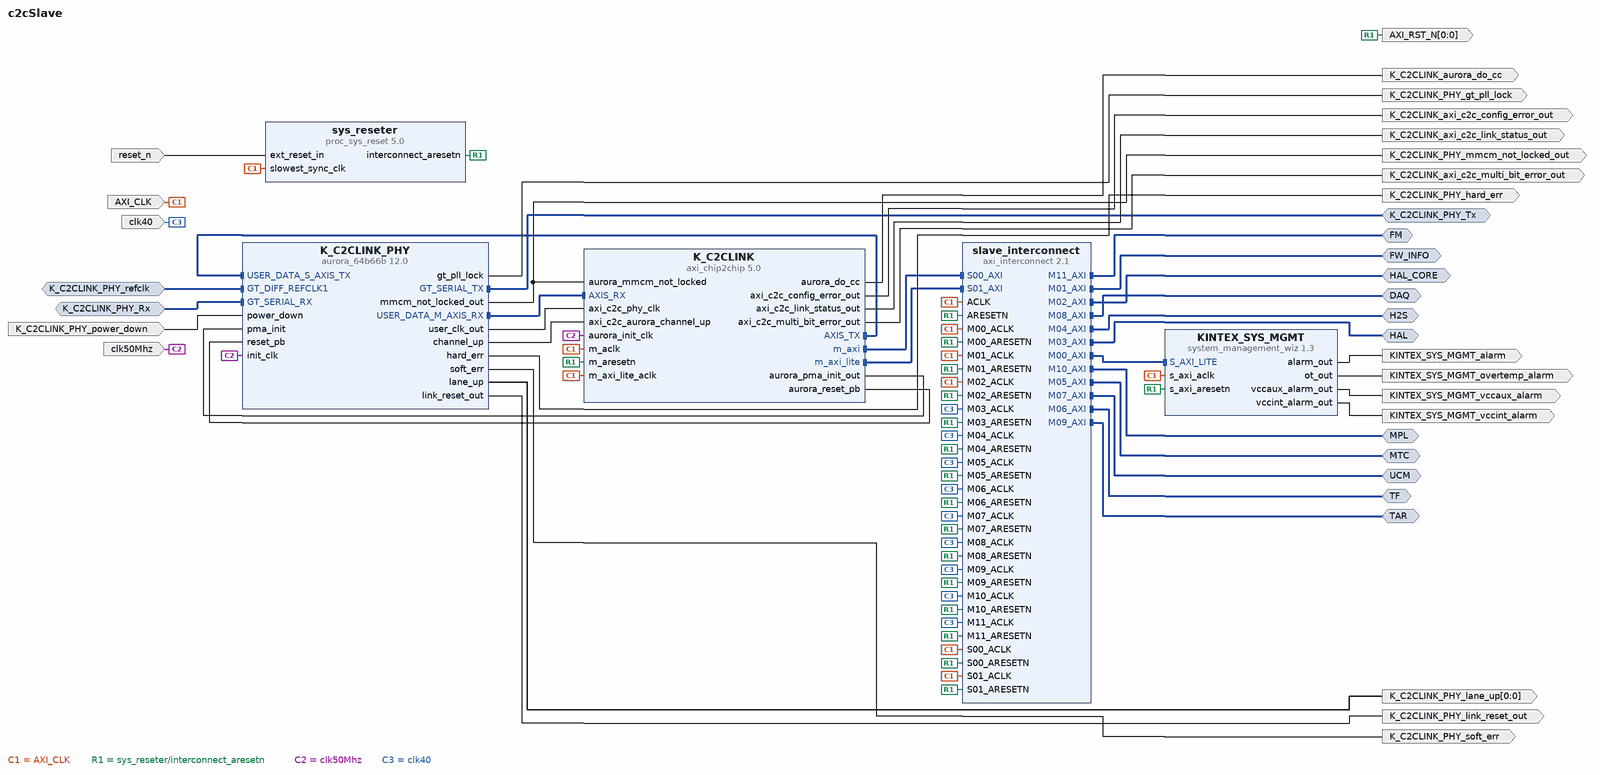
[diagram p0: block diagram of the top level]
# Vivado block design c2cSlave, xcku15p-ffva1760-2-e, Vivado 2020.2
create_bd_design c2cSlave

create_bd_intf_port -mode Slave -vlnv xilinx.com:interface:diff_clock_rtl:1.0 K_C2CLINK_PHY_refclk
set_property -dict {CONFIG.FREQ_HZ 200000000} [get_bd_intf_ports K_C2CLINK_PHY_refclk]
create_bd_intf_port -mode Slave -vlnv xilinx.com:display_aurora:GT_Serial_Transceiver_Pins_RX_rtl:1.0 K_C2CLINK_PHY_Rx
create_bd_intf_port -mode Master -vlnv xilinx.com:display_aurora:GT_Serial_Transceiver_Pins_TX_rtl:1.0 K_C2CLINK_PHY_Tx
create_bd_intf_port -mode Master -vlnv xilinx.com:interface:aximm_rtl:1.0 FW_INFO
set_property -dict [list \
  CONFIG.ADDR_WIDTH 32 \
  CONFIG.DATA_WIDTH 32 \
  CONFIG.FREQ_HZ 50000000 \
  CONFIG.HAS_BURST 0 \
  CONFIG.HAS_CACHE 0 \
  CONFIG.HAS_LOCK 0 \
  CONFIG.HAS_QOS 0 \
  CONFIG.HAS_REGION 0 \
  CONFIG.PROTOCOL AXI4LITE \
] [get_bd_intf_ports FW_INFO]
create_bd_intf_port -mode Master -vlnv xilinx.com:interface:aximm_rtl:1.0 HAL_CORE
set_property -dict [list \
  CONFIG.ADDR_WIDTH 32 \
  CONFIG.DATA_WIDTH 32 \
  CONFIG.FREQ_HZ 50000000 \
  CONFIG.HAS_BURST 0 \
  CONFIG.HAS_CACHE 0 \
  CONFIG.HAS_LOCK 0 \
  CONFIG.HAS_QOS 0 \
  CONFIG.HAS_REGION 0 \
  CONFIG.PROTOCOL AXI4LITE \
] [get_bd_intf_ports HAL_CORE]
create_bd_intf_port -mode Master -vlnv xilinx.com:interface:aximm_rtl:1.0 HAL
set_property -dict [list \
  CONFIG.ADDR_WIDTH 32 \
  CONFIG.DATA_WIDTH 32 \
  CONFIG.HAS_BURST 0 \
  CONFIG.HAS_CACHE 0 \
  CONFIG.HAS_LOCK 0 \
  CONFIG.HAS_QOS 0 \
  CONFIG.HAS_REGION 0 \
  CONFIG.PROTOCOL AXI4LITE \
] [get_bd_intf_ports HAL]
create_bd_intf_port -mode Master -vlnv xilinx.com:interface:aximm_rtl:1.0 H2S
set_property -dict [list \
  CONFIG.ADDR_WIDTH 32 \
  CONFIG.DATA_WIDTH 32 \
  CONFIG.HAS_BURST 0 \
  CONFIG.HAS_CACHE 0 \
  CONFIG.HAS_LOCK 0 \
  CONFIG.HAS_QOS 0 \
  CONFIG.HAS_REGION 0 \
  CONFIG.PROTOCOL AXI4LITE \
] [get_bd_intf_ports H2S]
create_bd_intf_port -mode Master -vlnv xilinx.com:interface:aximm_rtl:1.0 MTC
set_property -dict [list \
  CONFIG.ADDR_WIDTH 32 \
  CONFIG.DATA_WIDTH 32 \
  CONFIG.HAS_BURST 0 \
  CONFIG.HAS_CACHE 0 \
  CONFIG.HAS_LOCK 0 \
  CONFIG.HAS_QOS 0 \
  CONFIG.HAS_REGION 0 \
  CONFIG.PROTOCOL AXI4LITE \
] [get_bd_intf_ports MTC]
create_bd_intf_port -mode Master -vlnv xilinx.com:interface:aximm_rtl:1.0 TF
set_property -dict [list \
  CONFIG.ADDR_WIDTH 32 \
  CONFIG.DATA_WIDTH 32 \
  CONFIG.HAS_BURST 0 \
  CONFIG.HAS_CACHE 0 \
  CONFIG.HAS_LOCK 0 \
  CONFIG.HAS_QOS 0 \
  CONFIG.HAS_REGION 0 \
  CONFIG.PROTOCOL AXI4LITE \
] [get_bd_intf_ports TF]
create_bd_intf_port -mode Master -vlnv xilinx.com:interface:aximm_rtl:1.0 UCM
set_property -dict [list \
  CONFIG.ADDR_WIDTH 32 \
  CONFIG.DATA_WIDTH 32 \
  CONFIG.HAS_BURST 0 \
  CONFIG.HAS_CACHE 0 \
  CONFIG.HAS_LOCK 0 \
  CONFIG.HAS_QOS 0 \
  CONFIG.HAS_REGION 0 \
  CONFIG.PROTOCOL AXI4LITE \
] [get_bd_intf_ports UCM]
create_bd_intf_port -mode Master -vlnv xilinx.com:interface:aximm_rtl:1.0 DAQ
set_property -dict [list \
  CONFIG.ADDR_WIDTH 32 \
  CONFIG.DATA_WIDTH 32 \
  CONFIG.HAS_BURST 0 \
  CONFIG.HAS_CACHE 0 \
  CONFIG.HAS_LOCK 0 \
  CONFIG.HAS_QOS 0 \
  CONFIG.HAS_REGION 0 \
  CONFIG.PROTOCOL AXI4LITE \
] [get_bd_intf_ports DAQ]
create_bd_intf_port -mode Master -vlnv xilinx.com:interface:aximm_rtl:1.0 TAR
set_property -dict [list \
  CONFIG.ADDR_WIDTH 32 \
  CONFIG.DATA_WIDTH 32 \
  CONFIG.HAS_BURST 0 \
  CONFIG.HAS_CACHE 0 \
  CONFIG.HAS_LOCK 0 \
  CONFIG.HAS_QOS 0 \
  CONFIG.HAS_REGION 0 \
  CONFIG.PROTOCOL AXI4LITE \
] [get_bd_intf_ports TAR]
create_bd_intf_port -mode Master -vlnv xilinx.com:interface:aximm_rtl:1.0 MPL
set_property -dict [list \
  CONFIG.ADDR_WIDTH 32 \
  CONFIG.DATA_WIDTH 32 \
  CONFIG.HAS_BURST 0 \
  CONFIG.HAS_CACHE 0 \
  CONFIG.HAS_LOCK 0 \
  CONFIG.HAS_QOS 0 \
  CONFIG.HAS_REGION 0 \
  CONFIG.PROTOCOL AXI4LITE \
] [get_bd_intf_ports MPL]
create_bd_intf_port -mode Master -vlnv xilinx.com:interface:aximm_rtl:1.0 FM
set_property -dict [list \
  CONFIG.ADDR_WIDTH 32 \
  CONFIG.DATA_WIDTH 32 \
  CONFIG.HAS_BURST 0 \
  CONFIG.HAS_CACHE 0 \
  CONFIG.HAS_LOCK 0 \
  CONFIG.HAS_QOS 0 \
  CONFIG.HAS_REGION 0 \
  CONFIG.PROTOCOL AXI4LITE \
] [get_bd_intf_ports FM]
create_bd_port -dir I -type clk clk50Mhz
set_property -dict {CONFIG.FREQ_HZ 50000000} [get_bd_ports clk50Mhz]
create_bd_port -dir I -type rst reset_n
create_bd_port -dir I -type clk AXI_CLK
set_property -dict {CONFIG.ASSOCIATED_BUSIF HAL_CORE:FW_INFO CONFIG.FREQ_HZ 50000000} [get_bd_ports AXI_CLK]
create_bd_port -dir O -from 0 -to 0 -type rst AXI_RST_N
create_bd_port -dir O K_C2CLINK_aurora_do_cc
create_bd_port -dir O K_C2CLINK_axi_c2c_config_error_out
create_bd_port -dir O K_C2CLINK_axi_c2c_link_status_out
create_bd_port -dir O K_C2CLINK_axi_c2c_multi_bit_error_out
create_bd_port -dir I -type rst K_C2CLINK_PHY_power_down
create_bd_port -dir O K_C2CLINK_PHY_gt_pll_lock
create_bd_port -dir O K_C2CLINK_PHY_hard_err
create_bd_port -dir O K_C2CLINK_PHY_soft_err
create_bd_port -dir O -from 0 -to 0 K_C2CLINK_PHY_lane_up
create_bd_port -dir O K_C2CLINK_PHY_mmcm_not_locked_out
create_bd_port -dir O -type rst K_C2CLINK_PHY_link_reset_out
create_bd_port -dir O KINTEX_SYS_MGMT_alarm
create_bd_port -dir O KINTEX_SYS_MGMT_vccint_alarm
create_bd_port -dir O KINTEX_SYS_MGMT_vccaux_alarm
create_bd_port -dir O KINTEX_SYS_MGMT_overtemp_alarm
create_bd_port -dir I -type clk clk40
set_property -dict {CONFIG.ASSOCIATED_BUSIF FM:HAL:H2S:MTC:TF:UCM:DAQ:TAR:MPL} [get_bd_ports clk40]

create_bd_cell -type ip -vlnv xilinx.com:ip:proc_sys_reset:5.0 sys_reseter
create_bd_cell -type ip -vlnv xilinx.com:ip:axi_chip2chip:5.0 K_C2CLINK
set_property -dict [list \
  CONFIG.C_AXI_DATA_WIDTH 32 \
  CONFIG.C_AXI_STB_WIDTH 4 \
  CONFIG.C_EN_AXI_LINK_HNDLR false \
  CONFIG.C_INCLUDE_AXILITE 2 \
  CONFIG.C_INTERFACE_MODE 0 \
  CONFIG.C_INTERFACE_TYPE 2 \
  CONFIG.C_MASTER_FPGA 0 \
  CONFIG.C_M_AXI_ID_WIDTH 0 \
  CONFIG.C_M_AXI_WUSER_WIDTH 0 \
] [get_bd_cells K_C2CLINK]
create_bd_cell -type ip -vlnv xilinx.com:ip:aurora_64b66b:12.0 K_C2CLINK_PHY
set_property -dict [list \
  CONFIG.CHANNEL_ENABLE X0Y0 \
  CONFIG.C_AURORA_LANES 1 \
  CONFIG.C_LINE_RATE 5 \
  CONFIG.C_REFCLK_FREQUENCY 200 \
  CONFIG.C_USE_CHIPSCOPE true \
  CONFIG.SupportLevel 1 \
  CONFIG.drp_mode AXI4_LITE \
  CONFIG.interface_mode Streaming \
] [get_bd_cells K_C2CLINK_PHY]
create_bd_cell -type ip -vlnv xilinx.com:ip:axi_interconnect:2.1 slave_interconnect
set_property -dict {CONFIG.NUM_MI 12 CONFIG.NUM_SI 2} [get_bd_cells slave_interconnect]
create_bd_cell -type ip -vlnv xilinx.com:ip:system_management_wiz:1.3 KINTEX_SYS_MGMT
set_property -dict {CONFIG.USER_TEMP_ALARM false} [get_bd_cells KINTEX_SYS_MGMT]

# ---- connections ----

connect_bd_intf_net [get_bd_intf_ports HAL_CORE] [get_bd_intf_pins slave_interconnect/M02_AXI]
connect_bd_intf_net [get_bd_intf_pins KINTEX_SYS_MGMT/S_AXI_LITE] [get_bd_intf_pins slave_interconnect/M00_AXI]
connect_bd_intf_net [get_bd_intf_ports FW_INFO] [get_bd_intf_pins slave_interconnect/M01_AXI]
connect_bd_intf_net [get_bd_intf_pins K_C2CLINK/m_axi] [get_bd_intf_pins slave_interconnect/S00_AXI]
connect_bd_intf_net [get_bd_intf_pins K_C2CLINK/m_axi_lite] [get_bd_intf_pins slave_interconnect/S01_AXI]
connect_bd_intf_net [get_bd_intf_ports FM] [get_bd_intf_pins slave_interconnect/M11_AXI]
connect_bd_intf_net [get_bd_intf_ports H2S] [get_bd_intf_pins slave_interconnect/M04_AXI]
connect_bd_intf_net [get_bd_intf_ports HAL] [get_bd_intf_pins slave_interconnect/M03_AXI]
connect_bd_intf_net [get_bd_intf_ports MPL] [get_bd_intf_pins slave_interconnect/M10_AXI]
connect_bd_intf_net [get_bd_intf_ports UCM] [get_bd_intf_pins slave_interconnect/M07_AXI]
connect_bd_intf_net [get_bd_intf_ports DAQ] [get_bd_intf_pins slave_interconnect/M08_AXI]
connect_bd_intf_net [get_bd_intf_ports TF] [get_bd_intf_pins slave_interconnect/M06_AXI]
connect_bd_intf_net [get_bd_intf_ports K_C2CLINK_PHY_refclk] [get_bd_intf_pins K_C2CLINK_PHY/GT_DIFF_REFCLK1]
connect_bd_intf_net [get_bd_intf_ports MTC] [get_bd_intf_pins slave_interconnect/M05_AXI]
connect_bd_intf_net [get_bd_intf_ports K_C2CLINK_PHY_Tx] [get_bd_intf_pins K_C2CLINK_PHY/GT_SERIAL_TX]
connect_bd_intf_net [get_bd_intf_ports K_C2CLINK_PHY_Rx] [get_bd_intf_pins K_C2CLINK_PHY/GT_SERIAL_RX]
connect_bd_intf_net [get_bd_intf_ports TAR] [get_bd_intf_pins slave_interconnect/M09_AXI]
connect_bd_intf_net [get_bd_intf_pins K_C2CLINK/AXIS_TX] [get_bd_intf_pins K_C2CLINK_PHY/USER_DATA_S_AXIS_TX]
connect_bd_intf_net [get_bd_intf_pins K_C2CLINK_PHY/USER_DATA_M_AXIS_RX] [get_bd_intf_pins K_C2CLINK/AXIS_RX]
connect_bd_net [get_bd_ports reset_n] [get_bd_pins sys_reseter/ext_reset_in]
connect_bd_net [get_bd_ports AXI_CLK] \
  [get_bd_pins sys_reseter/slowest_sync_clk] [get_bd_pins K_C2CLINK/m_aclk] [get_bd_pins K_C2CLINK/m_axi_lite_aclk] \
  [get_bd_pins slave_interconnect/ACLK] [get_bd_pins slave_interconnect/S00_ACLK] [get_bd_pins slave_interconnect/S01_ACLK] \
  [get_bd_pins slave_interconnect/M00_ACLK] [get_bd_pins KINTEX_SYS_MGMT/s_axi_aclk] \
  [get_bd_pins slave_interconnect/M01_ACLK] [get_bd_pins slave_interconnect/M02_ACLK]
connect_bd_net [get_bd_pins sys_reseter/interconnect_aresetn] \
  [get_bd_ports AXI_RST_N] [get_bd_pins K_C2CLINK/m_aresetn] [get_bd_pins slave_interconnect/ARESETN] \
  [get_bd_pins slave_interconnect/S00_ARESETN] [get_bd_pins slave_interconnect/S01_ARESETN] \
  [get_bd_pins slave_interconnect/M00_ARESETN] [get_bd_pins KINTEX_SYS_MGMT/s_axi_aresetn] \
  [get_bd_pins slave_interconnect/M01_ARESETN] [get_bd_pins slave_interconnect/M02_ARESETN] \
  [get_bd_pins slave_interconnect/M03_ARESETN] [get_bd_pins slave_interconnect/M04_ARESETN] \
  [get_bd_pins slave_interconnect/M05_ARESETN] [get_bd_pins slave_interconnect/M06_ARESETN] \
  [get_bd_pins slave_interconnect/M07_ARESETN] [get_bd_pins slave_interconnect/M08_ARESETN] \
  [get_bd_pins slave_interconnect/M09_ARESETN] [get_bd_pins slave_interconnect/M10_ARESETN] \
  [get_bd_pins slave_interconnect/M11_ARESETN]
connect_bd_net [get_bd_pins K_C2CLINK/aurora_do_cc] [get_bd_ports K_C2CLINK_aurora_do_cc]
connect_bd_net [get_bd_pins K_C2CLINK/axi_c2c_config_error_out] [get_bd_ports K_C2CLINK_axi_c2c_config_error_out]
connect_bd_net [get_bd_pins K_C2CLINK/axi_c2c_link_status_out] [get_bd_ports K_C2CLINK_axi_c2c_link_status_out]
connect_bd_net [get_bd_pins K_C2CLINK/axi_c2c_multi_bit_error_out] [get_bd_ports K_C2CLINK_axi_c2c_multi_bit_error_out]
connect_bd_net [get_bd_ports K_C2CLINK_PHY_power_down] [get_bd_pins K_C2CLINK_PHY/power_down]
connect_bd_net [get_bd_pins K_C2CLINK_PHY/gt_pll_lock] [get_bd_ports K_C2CLINK_PHY_gt_pll_lock]
connect_bd_net [get_bd_pins K_C2CLINK_PHY/hard_err] [get_bd_ports K_C2CLINK_PHY_hard_err]
connect_bd_net [get_bd_pins K_C2CLINK_PHY/soft_err] [get_bd_ports K_C2CLINK_PHY_soft_err]
connect_bd_net [get_bd_pins K_C2CLINK_PHY/lane_up] [get_bd_ports K_C2CLINK_PHY_lane_up]
connect_bd_net [get_bd_pins K_C2CLINK_PHY/mmcm_not_locked_out] \
  [get_bd_ports K_C2CLINK_PHY_mmcm_not_locked_out] [get_bd_pins K_C2CLINK/aurora_mmcm_not_locked]
connect_bd_net [get_bd_pins K_C2CLINK_PHY/link_reset_out] [get_bd_ports K_C2CLINK_PHY_link_reset_out]
connect_bd_net [get_bd_pins K_C2CLINK_PHY/user_clk_out] [get_bd_pins K_C2CLINK/axi_c2c_phy_clk]
connect_bd_net [get_bd_pins K_C2CLINK_PHY/channel_up] [get_bd_pins K_C2CLINK/axi_c2c_aurora_channel_up]
connect_bd_net [get_bd_pins K_C2CLINK/aurora_pma_init_out] [get_bd_pins K_C2CLINK_PHY/pma_init]
connect_bd_net [get_bd_pins K_C2CLINK/aurora_reset_pb] [get_bd_pins K_C2CLINK_PHY/reset_pb]
connect_bd_net [get_bd_ports clk50Mhz] [get_bd_pins K_C2CLINK_PHY/init_clk] [get_bd_pins K_C2CLINK/aurora_init_clk]
connect_bd_net [get_bd_pins KINTEX_SYS_MGMT/alarm_out] [get_bd_ports KINTEX_SYS_MGMT_alarm]
connect_bd_net [get_bd_pins KINTEX_SYS_MGMT/vccint_alarm_out] [get_bd_ports KINTEX_SYS_MGMT_vccint_alarm]
connect_bd_net [get_bd_pins KINTEX_SYS_MGMT/vccaux_alarm_out] [get_bd_ports KINTEX_SYS_MGMT_vccaux_alarm]
connect_bd_net [get_bd_pins KINTEX_SYS_MGMT/ot_out] [get_bd_ports KINTEX_SYS_MGMT_overtemp_alarm]
connect_bd_net -net clk40_1 [get_bd_ports clk40] \
  [get_bd_pins slave_interconnect/M03_ACLK] [get_bd_pins slave_interconnect/M04_ACLK] \
  [get_bd_pins slave_interconnect/M05_ACLK] [get_bd_pins slave_interconnect/M06_ACLK] \
  [get_bd_pins slave_interconnect/M07_ACLK] [get_bd_pins slave_interconnect/M08_ACLK] \
  [get_bd_pins slave_interconnect/M09_ACLK] [get_bd_pins slave_interconnect/M10_ACLK] \
  [get_bd_pins slave_interconnect/M11_ACLK]

# ---- address map ----
assign_bd_address -offset 0x83C45000 -range 4K -target_address_space [get_bd_addr_spaces K_C2CLINK/MAXI] [get_bd_addr_segs KINTEX_SYS_MGMT/S_AXI_LITE/Reg]
assign_bd_address -offset 0x83C46000 -range 4K -target_address_space [get_bd_addr_spaces K_C2CLINK/MAXI] [get_bd_addr_segs FW_INFO/Reg]
assign_bd_address -offset 0x83C47000 -range 4K -target_address_space [get_bd_addr_spaces K_C2CLINK/MAXI] [get_bd_addr_segs HAL_CORE/Reg]
assign_bd_address -offset 0x83C48000 -range 4K -target_address_space [get_bd_addr_spaces K_C2CLINK/MAXI] [get_bd_addr_segs HAL/Reg]
assign_bd_address -offset 0x83C49000 -range 4K -target_address_space [get_bd_addr_spaces K_C2CLINK/MAXI] [get_bd_addr_segs H2S/Reg]
assign_bd_address -offset 0x83C4A000 -range 4K -target_address_space [get_bd_addr_spaces K_C2CLINK/MAXI] [get_bd_addr_segs MTC/Reg]
assign_bd_address -offset 0x83C4B000 -range 4K -target_address_space [get_bd_addr_spaces K_C2CLINK/MAXI] [get_bd_addr_segs TF/Reg]
assign_bd_address -offset 0x83C4C000 -range 4K -target_address_space [get_bd_addr_spaces K_C2CLINK/MAXI] [get_bd_addr_segs UCM/Reg]
assign_bd_address -offset 0x83C4D000 -range 4K -target_address_space [get_bd_addr_spaces K_C2CLINK/MAXI] [get_bd_addr_segs DAQ/Reg]
assign_bd_address -offset 0x83C4E000 -range 4K -target_address_space [get_bd_addr_spaces K_C2CLINK/MAXI] [get_bd_addr_segs TAR/Reg]
assign_bd_address -offset 0x83C4F000 -range 4K -target_address_space [get_bd_addr_spaces K_C2CLINK/MAXI] [get_bd_addr_segs MPL/Reg]
assign_bd_address -offset 0x83C50000 -range 4K -target_address_space [get_bd_addr_spaces K_C2CLINK/MAXI] [get_bd_addr_segs FM/Reg]
assign_bd_address -offset 0x83C45000 -range 4K -target_address_space [get_bd_addr_spaces K_C2CLINK/MAXI-Lite] [get_bd_addr_segs KINTEX_SYS_MGMT/S_AXI_LITE/Reg]
assign_bd_address -offset 0x83C46000 -range 4K -target_address_space [get_bd_addr_spaces K_C2CLINK/MAXI-Lite] [get_bd_addr_segs FW_INFO/Reg]
assign_bd_address -offset 0x83C47000 -range 4K -target_address_space [get_bd_addr_spaces K_C2CLINK/MAXI-Lite] [get_bd_addr_segs HAL_CORE/Reg]
assign_bd_address -offset 0x83C48000 -range 4K -target_address_space [get_bd_addr_spaces K_C2CLINK/MAXI-Lite] [get_bd_addr_segs HAL/Reg]
assign_bd_address -offset 0x83C49000 -range 4K -target_address_space [get_bd_addr_spaces K_C2CLINK/MAXI-Lite] [get_bd_addr_segs H2S/Reg]
assign_bd_address -offset 0x83C4A000 -range 4K -target_address_space [get_bd_addr_spaces K_C2CLINK/MAXI-Lite] [get_bd_addr_segs MTC/Reg]
assign_bd_address -offset 0x83C4B000 -range 4K -target_address_space [get_bd_addr_spaces K_C2CLINK/MAXI-Lite] [get_bd_addr_segs TF/Reg]
assign_bd_address -offset 0x83C4C000 -range 4K -target_address_space [get_bd_addr_spaces K_C2CLINK/MAXI-Lite] [get_bd_addr_segs UCM/Reg]
assign_bd_address -offset 0x83C4D000 -range 4K -target_address_space [get_bd_addr_spaces K_C2CLINK/MAXI-Lite] [get_bd_addr_segs DAQ/Reg]
assign_bd_address -offset 0x83C4E000 -range 4K -target_address_space [get_bd_addr_spaces K_C2CLINK/MAXI-Lite] [get_bd_addr_segs TAR/Reg]
assign_bd_address -offset 0x83C4F000 -range 4K -target_address_space [get_bd_addr_spaces K_C2CLINK/MAXI-Lite] [get_bd_addr_segs MPL/Reg]
assign_bd_address -offset 0x83C50000 -range 4K -target_address_space [get_bd_addr_spaces K_C2CLINK/MAXI-Lite] [get_bd_addr_segs FM/Reg]

validate_bd_design
save_bd_design
